# Altium schematic sheet Dart_Controller_SCH2.SchDoc
size A4; SheetNumber: 3; SheetTotal: 3
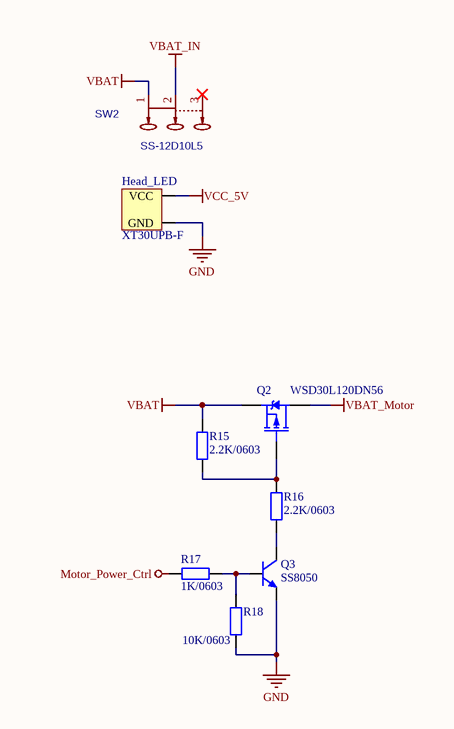
[diagram p0: Dart_Controller_SCH2.SchDoc]

## Parts
Head_LED  XT30UPB-F  [XT30PW-F]
Q2  WSD30L120DN56  [POWERVDFN-8_L6.0-W5.0-P1.27-BL]
Q3  SS8050  [SOT23-3L]
R15  2.2K/0603  [R 0603_M]
R16  2.2K/0603  [R 0603_M]
R17  1K/0603  [R 0603_M]
R18  10K/0603  [R 0603_M]
SW2  SS-12D10L5  [SW-TH_SS-12D10L5]

## Nets
GND: Head_LED.2(GND) Q3.2(E) R18.2
Motor_Power_Ctrl: R17.2
VBAT: Q2.S R15.2 SW2.1
VBAT_IN: SW2.2
VBAT_Motor: Q2.D
VCC_5V: Head_LED.1(VCC)
NetQ2_G: Q2.G R15.1 R16.2
NetQ3_1: Q3.1(B) R17.1 R18.1
NetQ3_3: Q3.3(C) R16.1

Not connected (* = marked no-connect by the designer): SW2 3*

## Library data of the parts
Head_LED = XT30-PW-F: 母头（卧式）
Q2 = WSD30L120DN56: P沟道场效应管
Q3 = SS8050-SMD: 高频放大-NPN型; 版权归属: 封装库来自淘宝 ID：黄晶宝石; 属性: 40V 1.5A 1W 100MHZ; BOM名称: 高频放大-NPN型; 联系售后: https://shop463601444.taobao.com
R15-R18 = R 0603: 贴片电阻; 版权归属: 来自淘宝 ID：黄晶宝石; BOM名称: 贴片电阻; 联系售后: https://shop463601444.taobao.com
SW2 = SS-12D10L5: 滑动开关; Manufacturer: XKB Connectivity(中国星坤); Contributor: LCSC; Supplier: LCSC; Supplier Part: C319012; Manufacturer Part: SS-12D10L5; spicePre: S; spiceSymbolName: SS-12D10L5